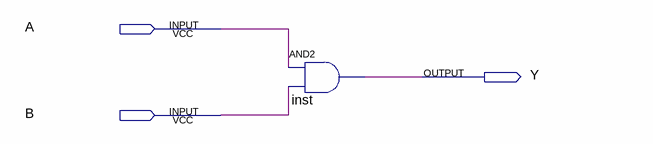
[diagram p0: schematic sheet]
// Quartus schematic my_and.bdf as structural Verilog: 1 symbols, 3 pins
module my_and (
  input  A,
  input  B,
  output Y
);

  and inst (Y, A, B);
endmodule
